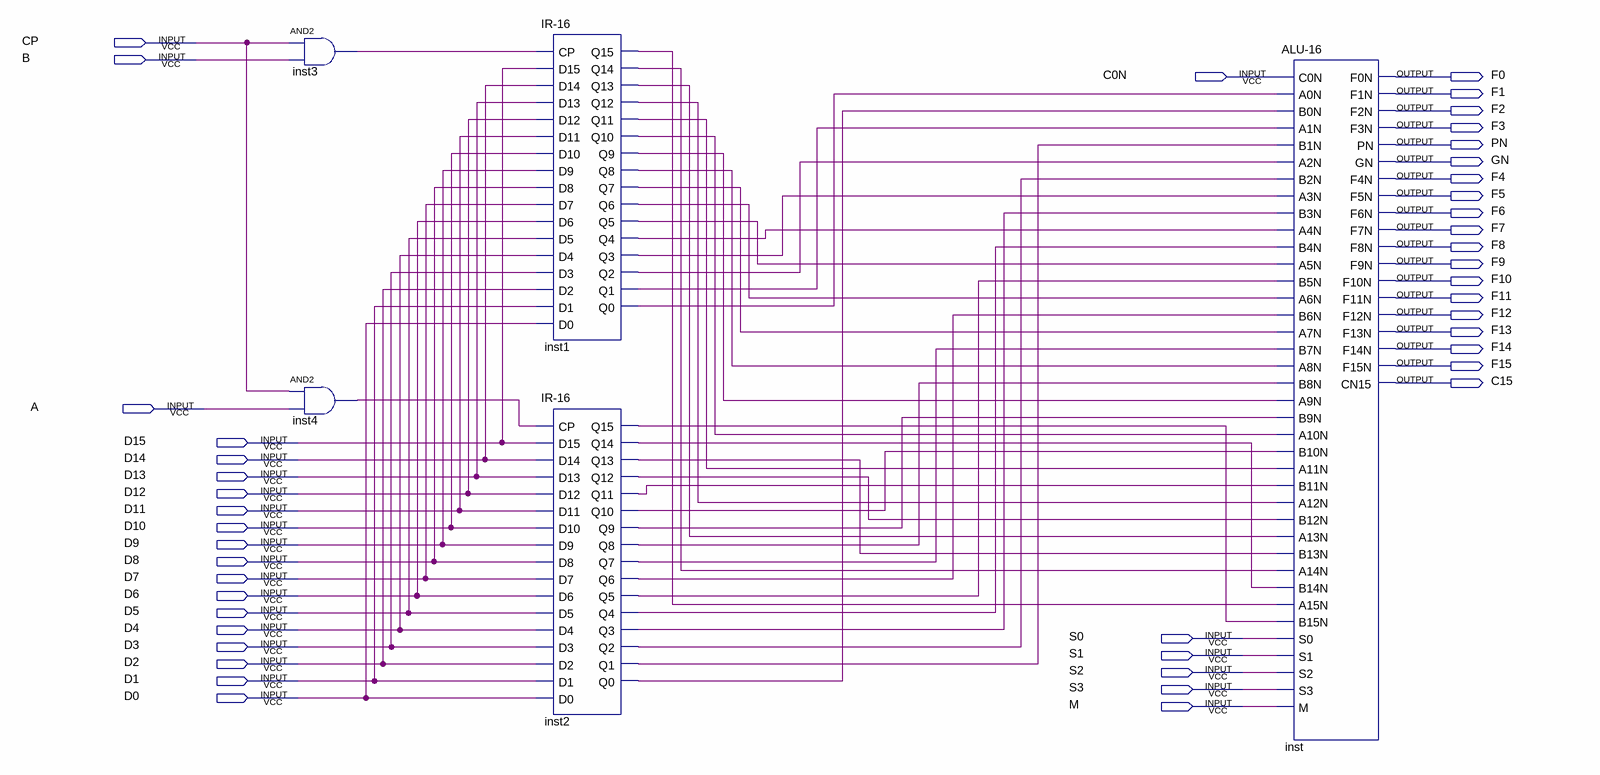
[diagram p0: schematic sheet]
// Quartus schematic ALU-16_for_Test.bdf as structural Verilog: 5 symbols, 44 pins
module \ALU-16_for_Test  (
  input  CP,
  input  B,
  input  C0N,
  input  A,
  input  D15,
  input  D14,
  input  D13,
  input  D12,
  input  D11,
  input  D10,
  input  D9,
  input  D8,
  input  D7,
  input  D6,
  input  D5,
  input  D4,
  input  S0,
  input  D3,
  input  S1,
  input  D2,
  input  S2,
  input  D1,
  input  S3,
  input  D0,
  input  M,
  output F0,
  output F1,
  output F2,
  output F3,
  output PN,
  output GN,
  output F4,
  output F5,
  output F6,
  output F7,
  output F8,
  output F9,
  output F10,
  output F11,
  output F12,
  output F13,
  output F14,
  output F15,
  output C15
);

  wire inst1_q0, inst1_q1, inst1_q2, inst1_q3, inst1_q4, inst1_q5, inst1_q6, inst1_q7, inst1_q8, inst1_q9,
       inst1_q10, inst1_q11, inst1_q12, inst1_q13, inst1_q14, inst1_q15, inst2_q0, inst2_q1, inst2_q2,
       inst2_q3, inst2_q4, inst2_q5, inst2_q6, inst2_q7, inst2_q8, inst2_q9, inst2_q10, inst2_q11, inst2_q12,
       inst2_q13, inst2_q14, inst2_q15, inst3_out, inst4_out;

  and inst3 (inst3_out, CP, B);
  and inst4 (inst4_out, CP, A);
  \IR-16  inst1 (
    .CP(inst3_out), .D15(D15), .D14(D14), .D13(D13), .D12(D12), .D11(D11), .D10(D10), .D9(D9), .D8(D8),
    .D7(D7), .D6(D6), .D5(D5), .D4(D4), .D3(D3), .D2(D2), .D1(D1), .D0(D0), .Q15(inst1_q15), .Q14(inst1_q14),
    .Q13(inst1_q13), .Q12(inst1_q12), .Q11(inst1_q11), .Q10(inst1_q10), .Q9(inst1_q9), .Q8(inst1_q8),
    .Q7(inst1_q7), .Q6(inst1_q6), .Q5(inst1_q5), .Q4(inst1_q4), .Q3(inst1_q3), .Q2(inst1_q2), .Q1(inst1_q1),
    .Q0(inst1_q0));
  \IR-16  inst2 (
    .CP(inst4_out), .D15(D15), .D14(D14), .D13(D13), .D12(D12), .D11(D11), .D10(D10), .D9(D9), .D8(D8),
    .D7(D7), .D6(D6), .D5(D5), .D4(D4), .D3(D3), .D2(D2), .D1(D1), .D0(D0), .Q15(inst2_q15), .Q14(inst2_q14),
    .Q13(inst2_q13), .Q12(inst2_q12), .Q11(inst2_q11), .Q10(inst2_q10), .Q9(inst2_q9), .Q8(inst2_q8),
    .Q7(inst2_q7), .Q6(inst2_q6), .Q5(inst2_q5), .Q4(inst2_q4), .Q3(inst2_q3), .Q2(inst2_q2), .Q1(inst2_q1),
    .Q0(inst2_q0));
  \ALU-16  inst (
    .C0N(C0N), .A0N(inst1_q0), .B0N(inst2_q0), .A1N(inst1_q1), .B1N(inst2_q1), .A2N(inst1_q2),
    .B2N(inst2_q2), .A3N(inst1_q3), .B3N(inst2_q3), .A4N(inst1_q4), .B4N(inst2_q4), .A5N(inst1_q5),
    .B5N(inst2_q5), .A6N(inst1_q6), .B6N(inst2_q6), .A7N(inst1_q7), .B7N(inst2_q7), .A8N(inst1_q8),
    .B8N(inst2_q8), .A9N(inst1_q9), .B9N(inst2_q9), .A10N(inst1_q10), .B10N(inst2_q10), .A11N(inst1_q11),
    .B11N(inst2_q11), .A12N(inst1_q12), .B12N(inst2_q12), .A13N(inst1_q13), .B13N(inst2_q13),
    .A14N(inst1_q14), .B14N(inst2_q14), .A15N(inst1_q15), .B15N(inst2_q15), .S0(S0), .S1(S1), .S2(S2),
    .S3(S3), .M(M), .F0N(F0), .F1N(F1), .F2N(F2), .F3N(F3), .PN(PN), .GN(GN), .F4N(F4), .F5N(F5), .F6N(F6),
    .F7N(F7), .F8N(F8), .F9N(F9), .F10N(F10), .F11N(F11), .F12N(F12), .F13N(F13), .F14N(F14), .F15N(F15),
    .CN15(C15));
endmodule
